# EAGLE design x2go_power_v1 (EAGLE 6.5.0)
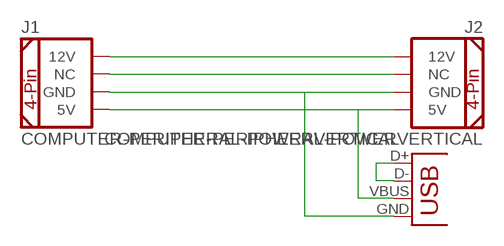
[diagram p0: schematic, sheet 1]

## Parts
J1  COMPUTER-PERIPHERAL-POWERVERTICAL  [COMPUTER-PERIPHERAL-POWER]
J2  COMPUTER-PERIPHERAL-POWERVERTICAL  [COMPUTER-PERIPHERAL-POWER]
JP1  USB-A-S  [USB-A-S]

## Nets
N$1: J1.12V J2.12V
N$2: J1.NC J2.NC
N$3: J1.GND J2.GND JP1.GND
N$4: J1.5V J2.5V JP1.VBUS
N$5: JP1.D+ JP1.D-

## Library data of the parts
J1 J2 = SparkFun-Connectors:COMPUTER-PERIPHERAL-POWER
JP1 = SparkFun-Connectors:USB: USB Connectors USB-B-PTH is fully proven SKU : PRT-00139/CONN-08278 USB-miniB is fully proven SKU : PRT-00587 USB-A-PCB is untested. USB-A-H is throughly reviewed, but untested. Spark Fun Electronics SKU : PRT-00437 USB-B-SMT is throughly reviewed, but untested. Needs silkscreen touching up. USB-A-S has not been used/tested USB-MB-H has not been used/tested USB-MICROB has been used. CONN-09505

## Board
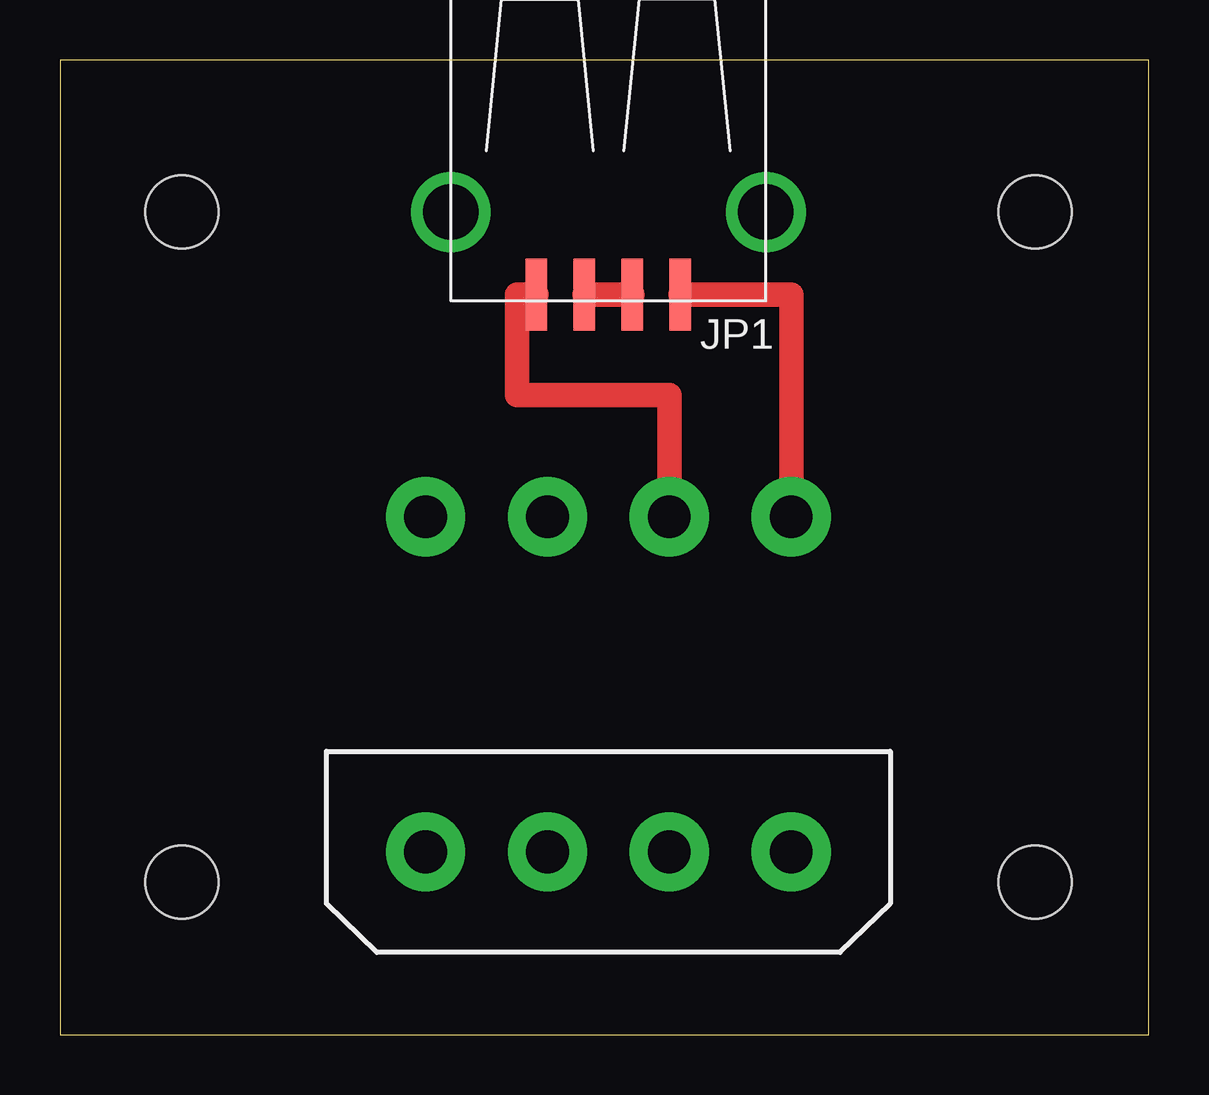
[diagram p1: board, top side]
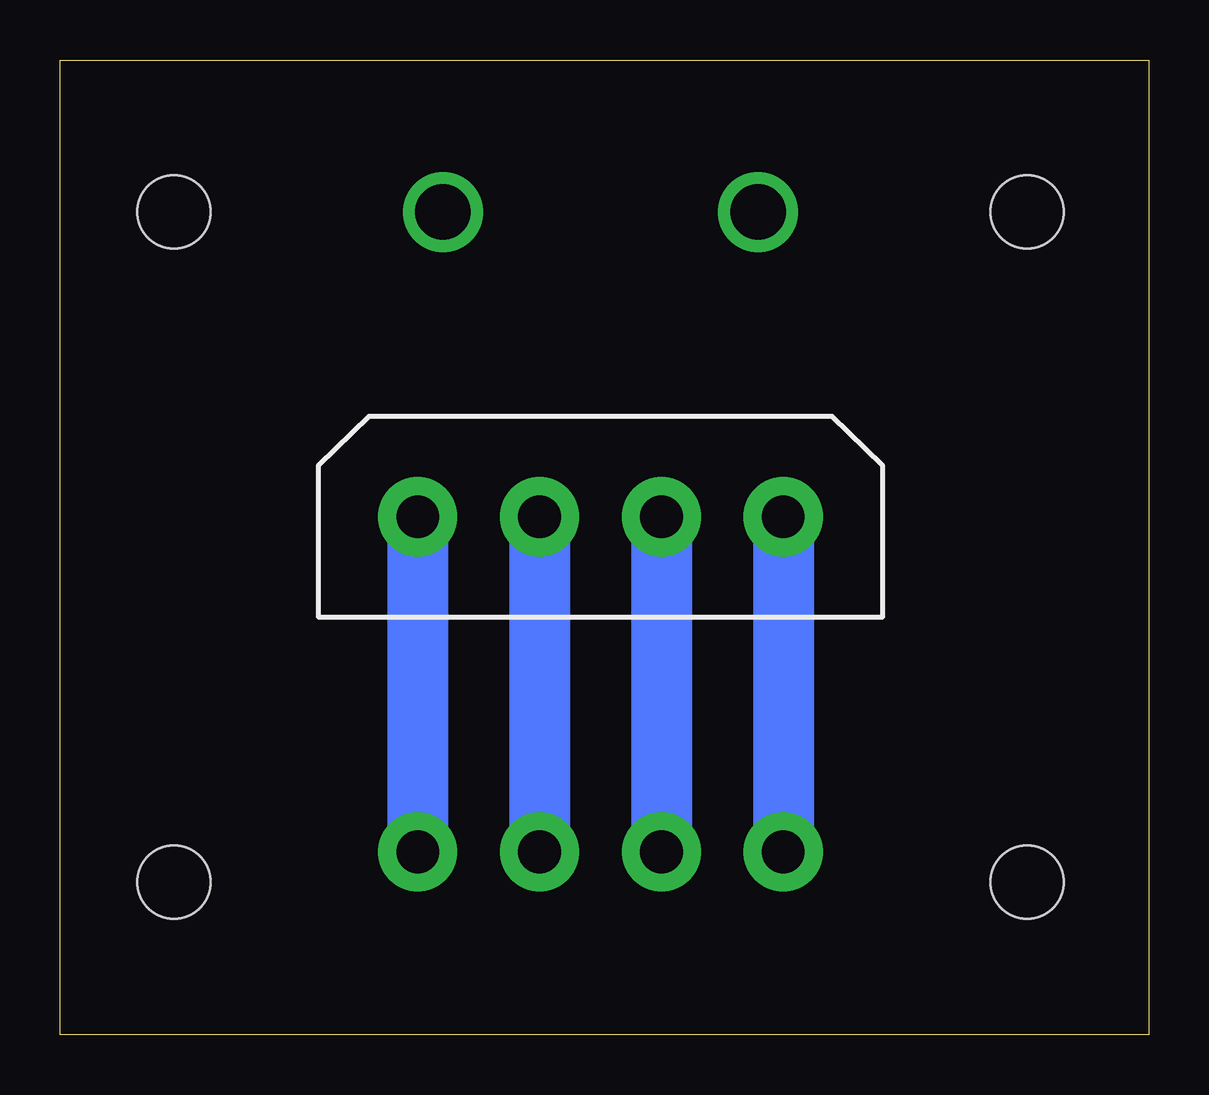
[diagram p2: board, bottom side, seen from below]

Size 45.39 x 40.63 mm. Coordinates in mm from the lower left corner, seen from the top.
Outline: 0,0 45.39,0 45.39,40.63 0,40.63 0,0
Copper layers (1*16): Top 0.035mm / dielectric 1.5mm / Bottom 0.035mm
Design rules "default": minimum track width 10mil, minimum drill 24mil, track to track 8mil, track to pad 8mil, pad to pad 8mil, via to via 8mil, smd to smd 8mil, copper to edge 40mil, drill to drill 8mil, minimum pad ring 10mil, minimum via ring 8mil, stop-mask expansion 4mil, vias tented up to drill 0mil, thermal gap 10mil
Holes 3.05 mm at 5.08,6.35 5.08,34.29 40.64,34.29 40.64,6.35

### Footprints (pad centres in the part's own frame; a part is rotated, then mirrored left to right if it is on the bottom)
COMPUTER-PERIPHERAL-POWER = drill 1.778 pad 3.302: 5V 7.62,0; 12V -7.62,0; GND 2.54,0; NC -2.54,0
USB-A-S = smd 3 x 0.9: D+ 3.45,-1; D- 3.45,1; GND 3.45,-3; VBUS 3.45,3 | drill 2.311: P$5 0,-6.566; P$6 0,6.566

### Placement (x,y rotation side)
J1  22.86,7.62 0 top
J2  22.86,21.59 180 bottom
JP1  22.86,34.29 270 top

### Tracks (layer width: path | path; a pad name or v marks a point on that pad's centre or on a via)
N$1
  Bottom 2.54: J2.12V J1.12V
N$2
  Bottom 2.54: J2.NC J1.NC
N$3
  Top 1.016: JP1.GND 19.05,30.84 19.05,26.67 25.4,26.67 J2.GND
  Bottom 2.54: J2.GND J1.GND
N$4
  Top 1.016: JP1.VBUS 30.48,30.84 J2.5V
  Bottom 2.54: J2.5V J1.5V
N$5
  Top 1.016: JP1.D+ JP1.D-